# EAGLE design env (EAGLE 5.11)

## Sheet 1 of 2
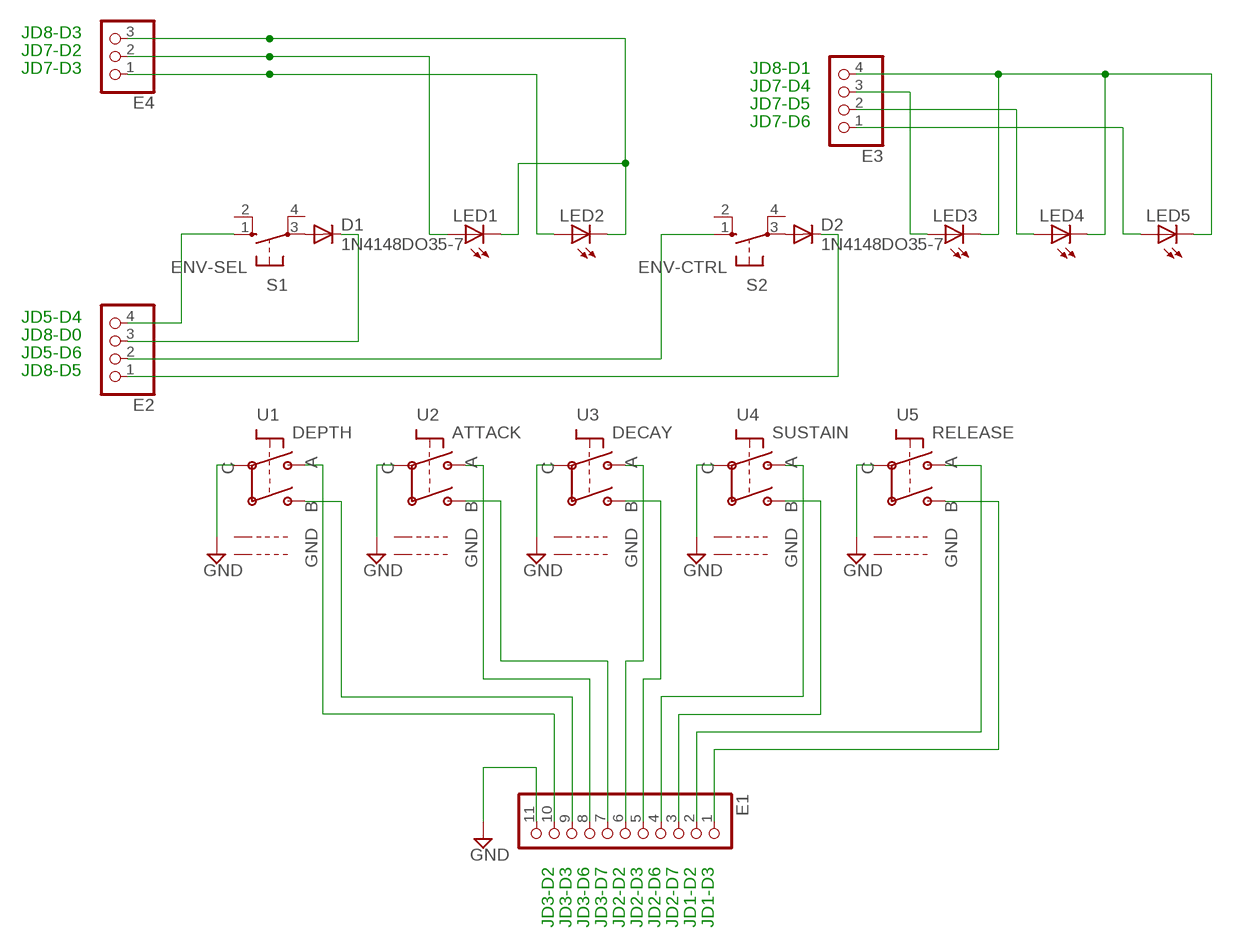
[diagram p0: schematic, sheet 1]

### Parts
D1  1N4148DO35-7  [DO35-7]
D2  1N4148DO35-7  [DO35-7]
E1  PINHD-1X11  [1X11]
E2  PINHD-1X4  [1X04]
E3  PINHD-1X4  [1X04]
E4  PINHD-1X3  [1X03]
LED1  LED3MM  [LED3MM]
LED2  LED3MM  [LED3MM]
LED3  LED3MM  [LED3MM]
LED4  LED3MM  [LED3MM]
LED5  LED3MM  [LED3MM]
S1  ENV-SEL  10-XX  [B3F-10XX]
S2  ENV-CTRL  10-XX  [B3F-10XX]
U1  DEPTH  ENC_ALPS_STEC16  [STEC16]
U2  ATTACK  ENC_ALPS_STEC16  [STEC16]
U3  DECAY  ENC_ALPS_STEC16  [STEC16]
U4  SUSTAIN  ENC_ALPS_STEC16  [STEC16]
U5  RELEASE  ENC_ALPS_STEC16  [STEC16]

### Nets
GND: E1.11 U1.P$C U2.P$C U3.P$C U4.P$C U5.P$C
N$1: E1.10 U1.P$A
N$2: E1.9 U1.P$B
N$3: D1.C E2.3
N$4: E1.8 U2.P$A
N$5: E1.7 U2.P$B
N$6: E1.6 U3.P$A
N$7: E1.5 U3.P$B
N$8: E4.3 LED1.K(C) LED2.K(C)
N$9: E1.4 U4.P$A
N$10: E1.3 U4.P$B
N$11: D1.A S1.3(P)
N$12: D2.A S2.3(P)
N$13: E2.4 S1.1(S)
N$14: E1.2 U5.P$A
N$15: E2.2 S2.1(S)
N$16: D2.C E2.1
N$17: E1.1 U5.P$B
N$19: E4.2 LED1.A
N$20: E4.1 LED2.A
N$21: E3.3 LED3.A
N$22: E3.2 LED4.A
N$23: E3.1 LED5.A
N$25: E3.4 LED3.K(C) LED4.K(C) LED5.K(C)
Unconnected: S1.2(S1) S1.4(P1) S2.2(S1) S2.4(P1) U1.P$GND1 U1.P$GND2 U2.P$GND1 U2.P$GND2 U3.P$GND1 U3.P$GND2 U4.P$GND1 U4.P$GND2 U5.P$GND1 U5.P$GND2

### Notes on the sheet
- JD8-D3
- JD7-D2
- JD7-D3 | JD8-D1
- JD7-D4
- JD7-D5
- JD7-D6
- JD5-D4
- JD8-D0
- JD5-D6
- JD8-D5
- JD3-D2 | JD3-D3 | JD3-D6 | JD3-D7 | JD2-D2 | JD2-D3 | JD2-D6 | JD2-D7 | JD1-D2 | JD1-D3

## Sheet 2 of 2

## Library data of the parts
D1 D2 = diode:1N4148: DIODE high speed (Philips)
E1 = pinhead:PINHD-1X11: PIN HEADER
E2 E3 = pinhead:PINHD-1X4: PIN HEADER
E4 = pinhead:PINHD-1X3: PIN HEADER
LED1-LED5 = led:LED: LED OSRAM: - CHIPLED LG R971, LG N971, LY N971, LG Q971, LY Q971, LO R971, LY R971 LH N974, LH R974 LS Q976, LO Q976, LY Q976 LO Q996 - Hyper CHIPLED LW Q18S LB Q993, LB Q99A, LB R99A - SideLED LS A670, LO A670, LY A670, LG A670, LP A670 LB A673, LV A673, LT A673, LW A673 LH A674 LY A675 LS A676, LA A676, LO A676, LY A676, LW A676 LS A679, LY A679, LG A679 - Hyper Micro SIDELED® LS Y876, LA Y876, LO Y876, LY Y876 LT Y87S - SmartLED LW L88C, LW L88S LB L89C, LB L89S, LG L890 LS L89K, LO L89K, LY L89K LS L896, LA L896, LO L896, LY L896 - TOPLED LS T670, LO T670, LY T670, LG T670, LP T670 LSG T670, LSP T670, LSY T670, LOP T670, LYG T670 LG T671, LOG T671, LSG T671 LB T673, LV T673, LT T673, LW T673 LH T674 LS T676, LA T676, LO T676, LY T676, LB T676, LH T676, LSB T676, LW T676 LB T67C, LV T67C, LT T67C, LS T67K, LO T67K, LY T67K, LW E67C LS E67B, LA E67B, LO E67B, LY E67B, LB E67C, LV E67C, LT E67C LW T67C LS T679, LY T679, LG T679 LS T770, LO T770, LY T770, LG T770, LP T770 LB T773, LV T773, LT T773, LW T773 LH T774 LS E675, LA E675, LY E675, LS T675 LS T776, LA T776, LO T776, LY T776, LB T776 LHGB T686 LT T68C, LB T68C - Hyper Mini TOPLED® LB M676 - Mini TOPLED Santana® LG M470 LS M47K, LO M47K, LY M47K Source: http://www.osram.convergy.de LUXEON: - LUMILED® LXK2-PW12-R00, LXK2-PW12-S00, LXK2-PW14-U00, LXK2-PW14-V00 LXK2-PM12-R00, LXK2-PM12-S00, LXK2-PM14-U00 LXK2-PE12-Q00, LXK2-PE12-R00, LXK2-PE12-S00, LXK2-PE14-T00, LXK2-PE14-U00 LXK2-PB12-K00, LXK2-PB12-L00, LXK2-PB12-M00, LXK2-PB14-N00, LXK2-PB14-P00, LXK2-PB14-Q00 LXK2-PR12-L00, LXK2-PR12-M00, LXK2-PR14-Q00, LXK2-PR14-R00 LXK2-PD12-Q00, LXK2-PD12-R00, LXK2-PD12-S00 LXK2-PH12-R00, LXK2-PH12-S00 LXK2-PL12-P00, LXK2-PL12-Q00, LXK2-PL12-R00 Source: www.luxeon.com KINGBRIGHT: KA-3528ASYC Source: www.kingbright.com
S1 S2 = switch-omron:10-XX: OMRON SWITCH; MPN: B3F-1000; OC_FARNELL: 176432; OC_NEWARK: 36M3542
U1-U5 = encoder:ENC

## Board
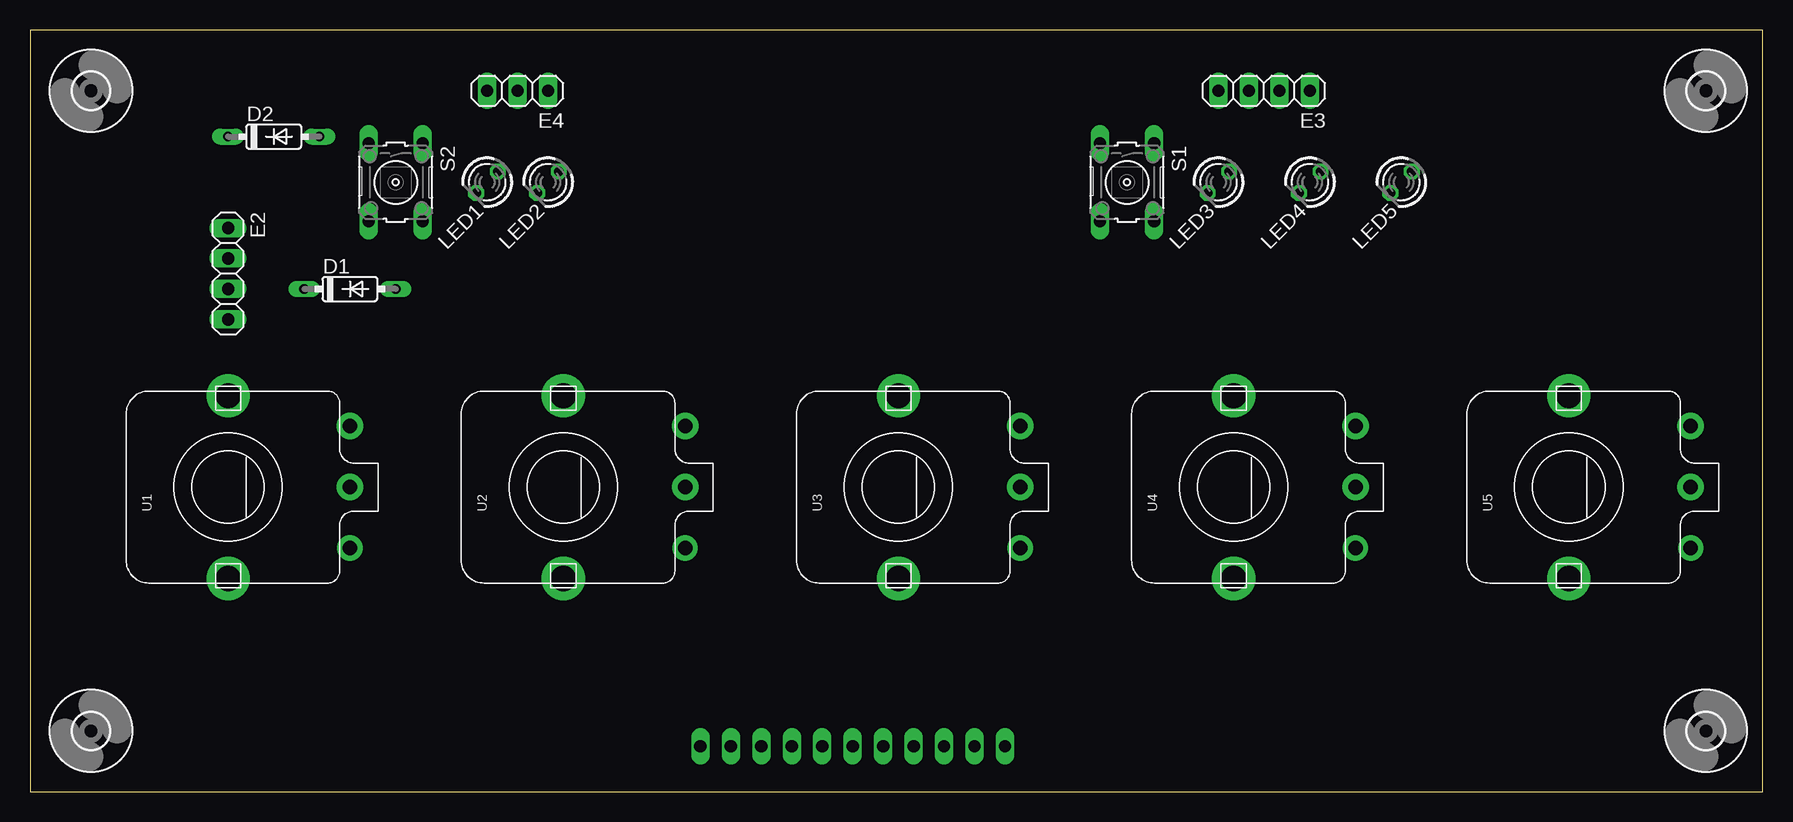
[diagram p1: board, top side]
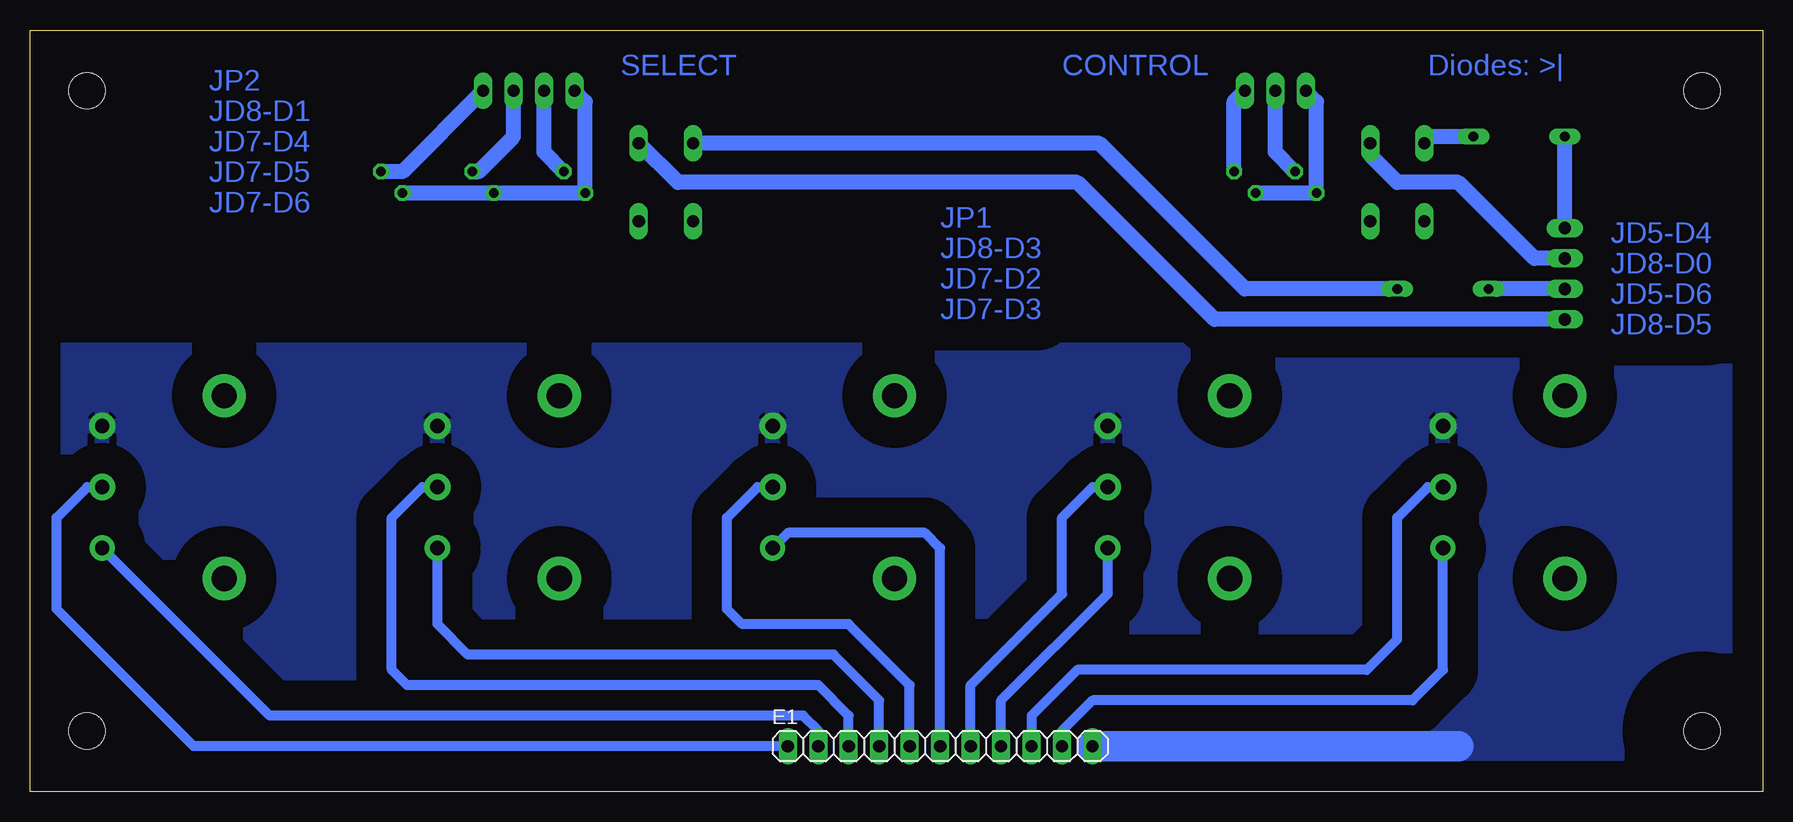
[diagram p2: board, bottom side, seen from below]

Size 144.45 x 63.49 mm. Coordinates in mm from the lower left corner, seen from the top.
Outline: 0,0 144.45,0 144.45,63.49 0,63.49 0,0
Copper layers (1*16): Top 0.035mm / dielectric 1.5mm / Bottom 0.035mm
Design rules "default": minimum track width 10mil, minimum drill 24mil, track to track 8mil, track to pad 8mil, pad to pad 8mil, via to via 8mil, smd to smd 8mil, copper to edge 40mil, drill to drill 8mil, minimum pad ring 10mil, minimum via ring 8mil, stop-mask expansion 4mil, vias tented up to drill 0mil, thermal gap 10mil

### Footprints (pad centres in the part's own frame; a part is rotated, then mirrored left to right if it is on the bottom)
DO35-7 = drill 0.813 long: A 3.81,0; C -3.81,0
1X11 = drill 1.016 long: 1 -12.7,0; 2 -10.16,0; 3 -7.62,0; 4 -5.08,0; 5 -2.54,0; 6 0,0; 7 2.54,0; 8 5.08,0; 9 7.62,0; 10 10.16,0; 11 12.7,0
1X04 = drill 1.016 long: 1 -3.81,0; 2 -1.27,0; 3 1.27,0; 4 3.81,0
1X03 = drill 1.016 long: 1 -2.54,0; 2 0,0; 3 2.54,0
LED3MM = drill 0.813 octagon: A -1.27,0; K 1.27,0
B3F-10XX = drill 1.016 long: 1 -3.251,2.261; 2 3.251,2.261; 3 -3.251,-2.261; 4 3.251,-2.261
STEC16 = drill 1.2 pad 2.1 round: P$A -5.08,-10.16 | drill 1.2 pad 2.2 round: P$B 0,-10.16; P$C 5.08,-10.16 | drill 2.1 pad 3.6 round: P$GND1 -7.62,0; P$GND2 7.62,0
3,0 = hole 3: 0,0

### Placement (x,y rotation side)
D1  26.67,41.91 0 top
D2  20.32,54.61 0 top
E1  68.58,3.81 0 bottom
E2  16.51,43.18 270 top
E3  102.87,58.42 180 top
E4  40.64,58.42 180 top
LED1  38.1,50.8 225 top
LED2  43.18,50.8 225 top
LED3  99.06,50.8 225 top
LED4  106.68,50.8 225 top
LED5  114.3,50.8 225 top
S1  91.44,50.8 270 top
S2  30.48,50.8 270 top
U1  16.51,25.4 90 top
U2  44.45,25.4 90 top
U3  72.39,25.4 90 top
U4  100.33,25.4 90 top
U5  128.27,25.4 90 top
U$1  [3,0]  5.08,5.08 0 top
U$2  [3,0]  139.7,5.08 0 top
U$3  [3,0]  5.08,58.42 0 top
U$4  [3,0]  139.7,58.42 0 top

### Tracks (layer width: path | path; a pad name or v marks a point on that pad's centre or on a via)
GND
  Bottom 2.54: 25.4,3.81 E1.11
  pour Bottom (isolate 2.54): -1.27,36.83 -1.27,-1.27 146.05,-1.27 146.05,36.83
N$1
  Bottom 0.813: E1.10 58.42,5.08 55.88,7.62 29.21,7.62 26.67,10.16 U1.P$A
N$2
  Bottom 0.813: E1.9 60.96,6.35 57.15,10.16 33.02,10.16 30.48,12.7 30.48,22.86 27.94,25.4 U1.P$B
N$3
  Bottom 1.27: E2.3 D1.C
N$4
  Bottom 0.813: U2.P$A 54.61,16.51 63.5,7.62 E1.8
N$5
  Bottom 0.813: E1.7 66.04,8.89 58.42,16.51 58.42,22.86 55.88,25.4 U2.P$B
N$6
  Bottom 0.813: E1.6 68.58,20.32 69.85,21.59 81.28,21.59 U3.P$A
N$7
  Bottom 0.813: E1.5 71.12,8.89 76.2,13.97 85.09,13.97 86.36,15.24 86.36,22.86 83.82,25.4 U3.P$B
N$8
  Bottom 1.27: E4.3 37.2,57.52 LED1.K LED2.K
N$9
  Bottom 0.813: E1.4 73.66,7.62 77.47,11.43 107.95,11.43 110.49,13.97 U4.P$A
N$10
  Bottom 0.813: E1.3 76.2,6.35 78.74,8.89 113.03,8.89 114.3,10.16 114.3,22.86 111.76,25.4 U4.P$B
N$11
  Bottom 1.27: S1.3 55.32,54.05 43.18,41.91 D1.A
N$12
  Bottom 1.27: D2.A 27.66,54.61 S2.3
N$13
  Bottom 1.27: E2.4 45.72,39.37 57.15,50.8 90.45,50.8 S1.1
N$14
  Bottom 0.813: E1.2 78.74,5.08 80.01,6.35 124.46,6.35 U5.P$A
N$15
  Bottom 1.27: S2.1 32.74,53.06 30.48,50.8 25.4,50.8 19.05,44.45 E2.2
N$16
  Bottom 1.27: E2.1 D2.C
N$17
  Bottom 0.813: E1.1 130.81,3.81 142.24,15.24 142.24,22.86 139.7,25.4 U5.P$B
N$19
  Bottom 1.27: E4.2 40.64,53.34 LED1.A
N$20
  Bottom 1.27: LED2.A 44.08,57.52 E4.1
N$21
  Bottom 1.27: LED3.A 101.6,53.34 E3.3
N$22
  Bottom 1.27: LED4.A 107.05,51.7 104.14,54.61 E3.2
N$23
  Bottom 1.27: LED5.A 113.4,51.7 E3.1
N$25
  Bottom 1.27: LED5.K LED4.K LED3.K 98.16,57.52 E3.4

### Text on the board
Bottom: Diodes: >| | CONTROL | SELECT | JP2 | JD8-D1 | JD7-D4 | JD7-D5 | JD7-D6 | JP1 | JD5-D4 | JD8-D3 | JD8-D0 | JD7-D2 | JD5-D6 | JD7-D3 | JD8-D5